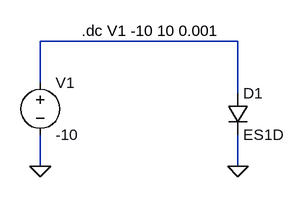
[diagram p0: schematic task_1.asc]
task_1.asc, the LTspice schematic file:
Version 4
SHEET 1 880 680
WIRE 224 80 -80 80
WIRE -80 144 -80 80
WIRE 224 160 224 80
WIRE -80 272 -80 224
WIRE 224 272 224 224
FLAG 224 272 0
FLAG -80 272 0
SYMBOL diode 208 160 R0
SYMATTR InstName D1
SYMATTR Value ES1D
SYMBOL voltage -80 128 R0
WINDOW 123 0 0 Left 0
WINDOW 39 0 0 Left 0
SYMATTR InstName V1
SYMATTR Value -10
TEXT -16 64 Left 2 !.dc V1 -10 10 0.001

The netlist it stands for:
* task_1.asc
D1 N001 0 ES1D
V1 N001 0 -10
.model D D
.lib standard.dio
.dc V1 -10 10 0.001
.backanno
.end